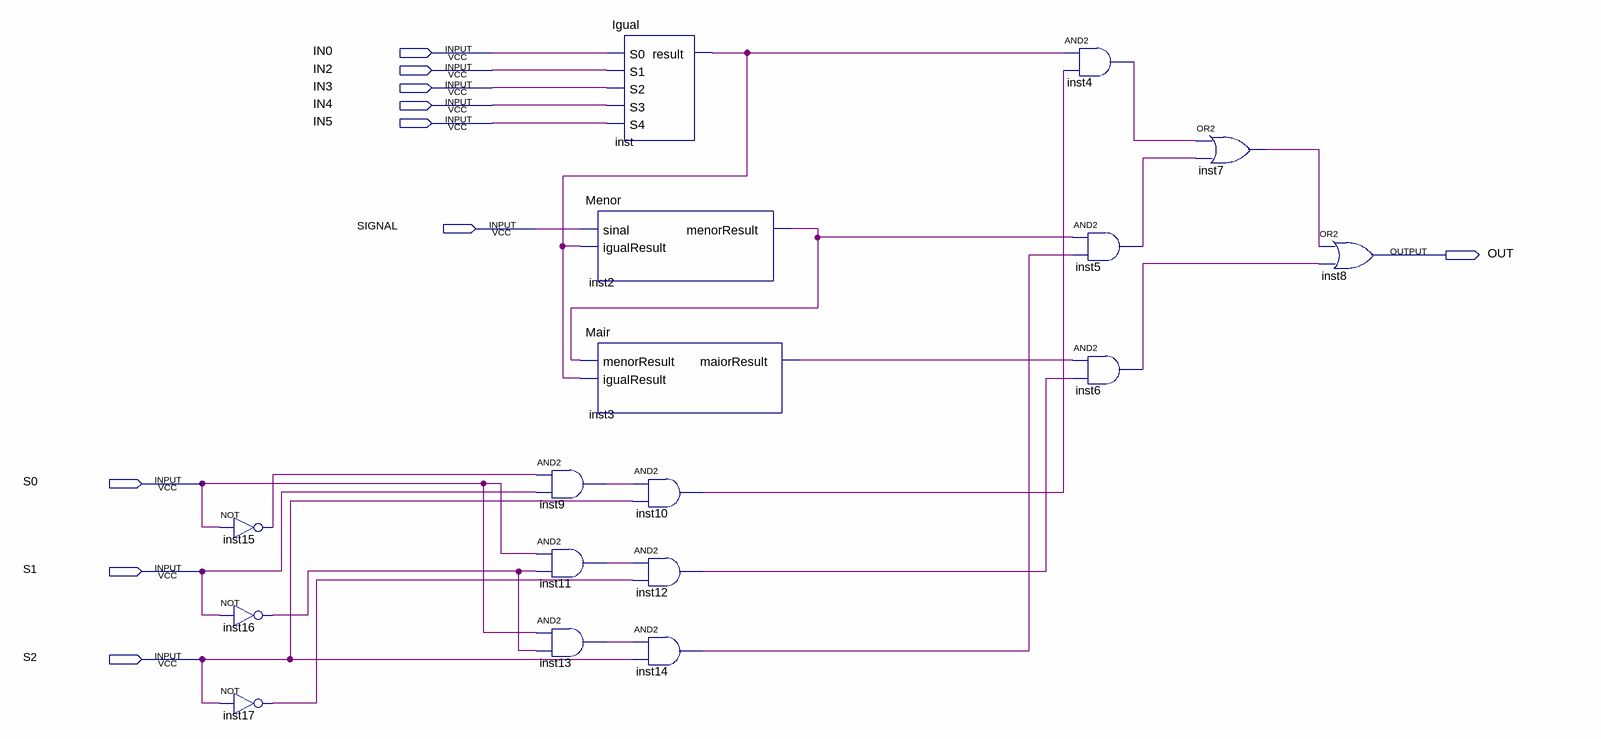
[diagram p0: schematic sheet]
// Quartus schematic sdProjectCompare.bdf as structural Verilog: 17 symbols, 10 pins
module sdProjectCompare (
  input  IN0,
  input  IN2,
  input  IN3,
  input  IN4,
  input  IN5,
  input  SIGNAL,
  input  S0,
  input  S1,
  input  S2,
  output OUT
);

  wire inst2_menorresult, inst3_maiorresult, inst4_out, inst5_out, inst6_out, inst7_out, inst9_out,
       inst10_out, inst11_out, inst12_out, inst13_out, inst14_out, inst15_out, inst16_out, inst17_out,
       inst_result;

  not inst15 (inst15_out, S0);
  not inst16 (inst16_out, S1);
  not inst17 (inst17_out, S2);
  and inst9 (inst9_out, inst15_out, S1);
  and inst11 (inst11_out, S0, inst16_out);
  and inst13 (inst13_out, S0, inst16_out);
  Igual inst (.S0(IN0), .S1(IN2), .S2(IN3), .S3(IN4), .S4(IN5), .result(inst_result));
  Menor inst2 (.sinal(SIGNAL), .igualResult(inst_result), .menorResult(inst2_menorresult));
  Mair inst3 (.menorResult(inst2_menorresult), .igualResult(inst_result), .maiorResult(inst3_maiorresult));
  and inst10 (inst10_out, inst9_out, S2);
  and inst12 (inst12_out, inst11_out, inst17_out);
  and inst14 (inst14_out, inst13_out, S2);
  and inst4 (inst4_out, inst_result, inst10_out);
  and inst5 (inst5_out, inst2_menorresult, inst14_out);
  and inst6 (inst6_out, inst3_maiorresult, inst12_out);
  or inst7 (inst7_out, inst4_out, inst5_out);
  or inst8 (OUT, inst7_out, inst6_out);
endmodule
